# EAGLE design 24CH-2x24CH (EAGLE 6.6.0)
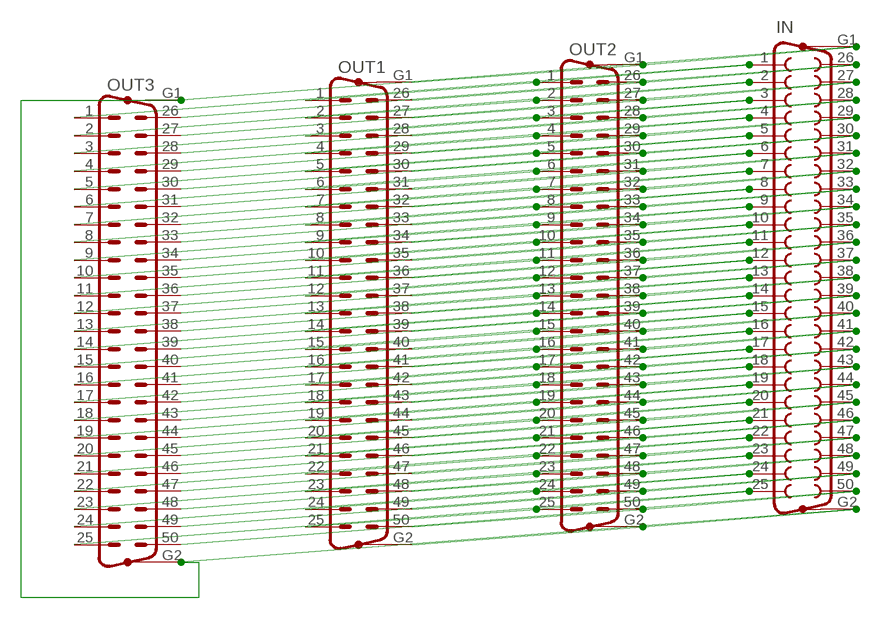
[diagram p0: schematic, sheet 1]

## Parts
IN  F50VP  [F50VP]
OUT1  M50VP  [M50VP]
OUT2  M50VP  [M50VP]
OUT3  M50VP  [M50VP]

## Nets
GND1: IN.G1 IN.G2 OUT1.G1 OUT1.G2 OUT2.G1 OUT2.G2 OUT3.G1 OUT3.G2
N$1: IN.35 OUT1.35 OUT2.35 OUT3.35
N$2: IN.38 OUT1.38 OUT2.38 OUT3.38
N$3: IN.1 OUT1.1 OUT2.1 OUT3.1
N$4: IN.18 OUT1.18 OUT2.18 OUT3.18
N$5: IN.2 OUT1.2 OUT2.2 OUT3.2
N$6: IN.19 OUT1.19 OUT2.19 OUT3.19
N$7: IN.3 OUT1.3 OUT2.3 OUT3.3
N$8: IN.20 OUT1.20 OUT2.20 OUT3.20
N$9: IN.4 OUT1.4 OUT2.4 OUT3.4
N$10: IN.21 OUT1.21 OUT2.21 OUT3.21
N$11: IN.5 OUT1.5 OUT2.5 OUT3.5
N$12: IN.22 OUT1.22 OUT2.22 OUT3.22
N$13: IN.6 OUT1.6 OUT2.6 OUT3.6
N$14: IN.23 OUT1.23 OUT2.23 OUT3.23
N$15: IN.7 OUT1.7 OUT2.7 OUT3.7
N$16: IN.24 OUT1.24 OUT2.24 OUT3.24
N$17: IN.8 OUT1.8 OUT2.8 OUT3.8
N$18: IN.25 OUT1.25 OUT2.25 OUT3.25
N$19: IN.9 OUT1.9 OUT2.9 OUT3.9
N$20: IN.26 OUT1.26 OUT2.26 OUT3.26
N$21: IN.10 OUT1.10 OUT2.10 OUT3.10
N$22: IN.27 OUT1.27 OUT2.27 OUT3.27
N$23: IN.11 OUT1.11 OUT2.11 OUT3.11
N$24: IN.28 OUT1.28 OUT2.28 OUT3.28
N$25: IN.12 OUT1.12 OUT2.12 OUT3.12
N$26: IN.29 OUT1.29 OUT2.29 OUT3.29
N$27: IN.13 OUT1.13 OUT2.13 OUT3.13
N$28: IN.30 OUT1.30 OUT2.30 OUT3.30
N$29: IN.14 OUT1.14 OUT2.14 OUT3.14
N$30: IN.31 OUT1.31 OUT2.31 OUT3.31
N$31: IN.15 OUT1.15 OUT2.15 OUT3.15
N$32: IN.32 OUT1.32 OUT2.32 OUT3.32
N$33: IN.16 OUT1.16 OUT2.16 OUT3.16
N$34: IN.33 OUT1.33 OUT2.33 OUT3.33
N$35: IN.17 OUT1.17 OUT2.17 OUT3.17
N$36: IN.40 OUT1.40 OUT2.40 OUT3.40
N$37: IN.39 OUT1.39 OUT2.39 OUT3.39
N$38: IN.34 OUT1.34 OUT2.34 OUT3.34
N$39: IN.36 OUT1.36 OUT2.36 OUT3.36
N$40: IN.37 OUT1.37 OUT2.37 OUT3.37
N$41: IN.41 OUT1.41 OUT2.41 OUT3.41
N$42: IN.42 OUT1.42 OUT2.42 OUT3.42
N$43: IN.43 OUT1.43 OUT2.43 OUT3.43
N$44: IN.44 OUT1.44 OUT2.44 OUT3.44
N$45: IN.45 OUT1.45 OUT2.45 OUT3.45
N$46: IN.46 OUT1.46 OUT2.46 OUT3.46
N$47: IN.47 OUT1.47 OUT2.47 OUT3.47
N$48: IN.48 OUT1.48 OUT2.48 OUT3.48
N$49: IN.49 OUT1.49 OUT2.49 OUT3.49
N$50: IN.50 OUT1.50 OUT2.50 OUT3.50

## Library data of the parts
IN = con-subd:F50VP: SUB-D; OC_FARNELL: unknown; OC_NEWARK: unknown
OUT1-OUT3 = con-subd:M50VP: SUB-D; OC_FARNELL: unknown; OC_NEWARK: unknown

## Board
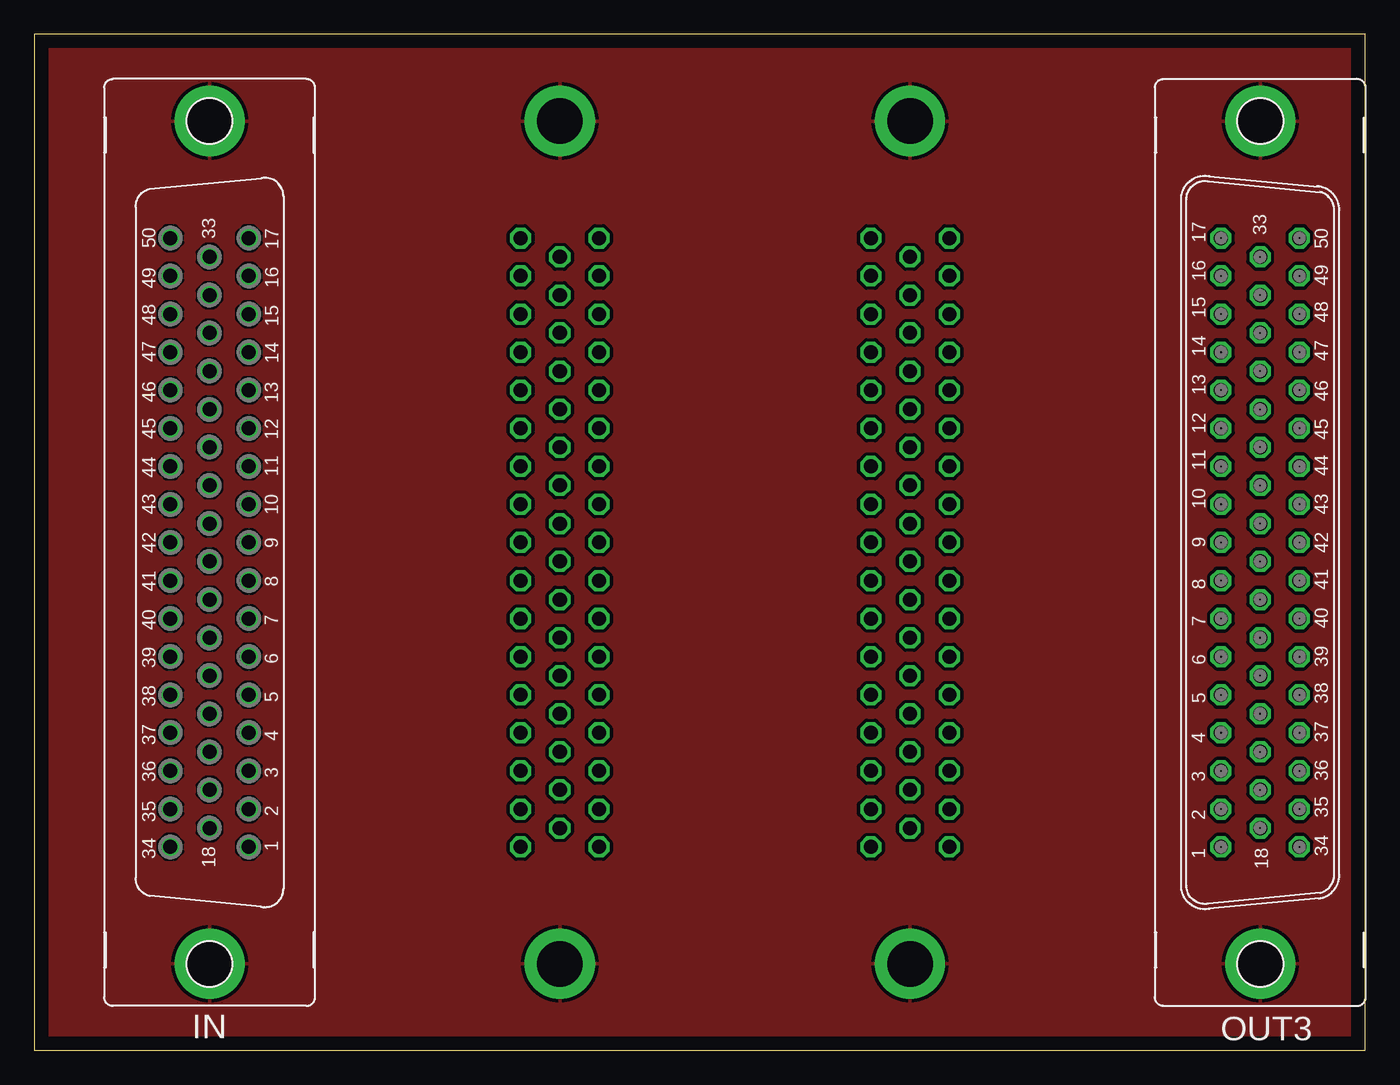
[diagram p1: board, top side]
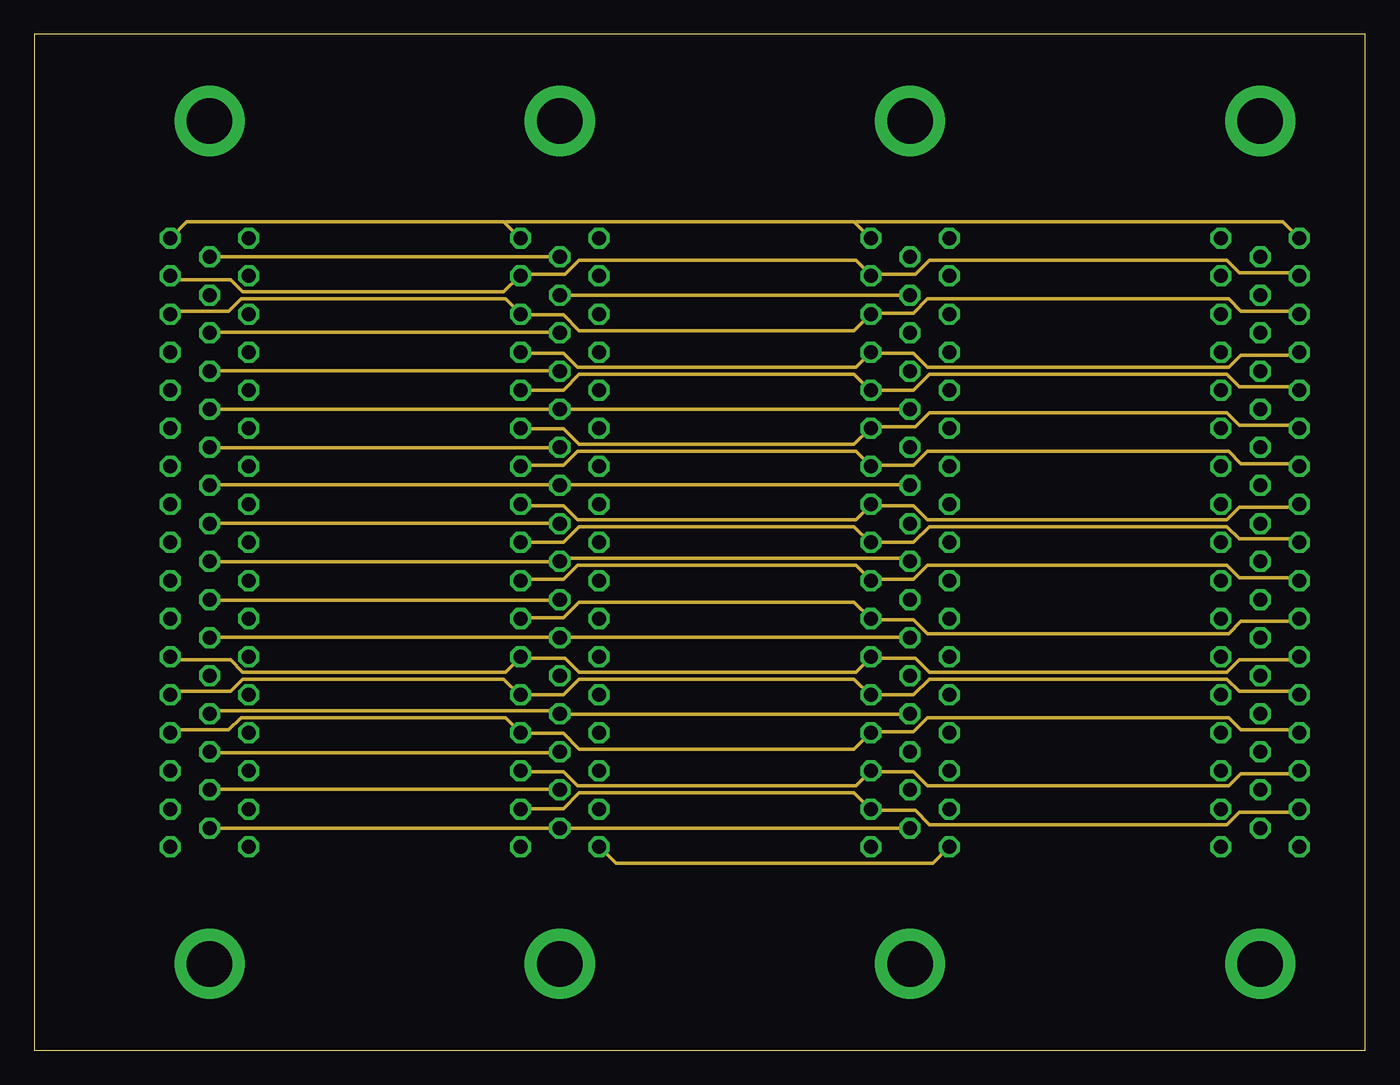
[diagram p2: board, inner layer Route2]
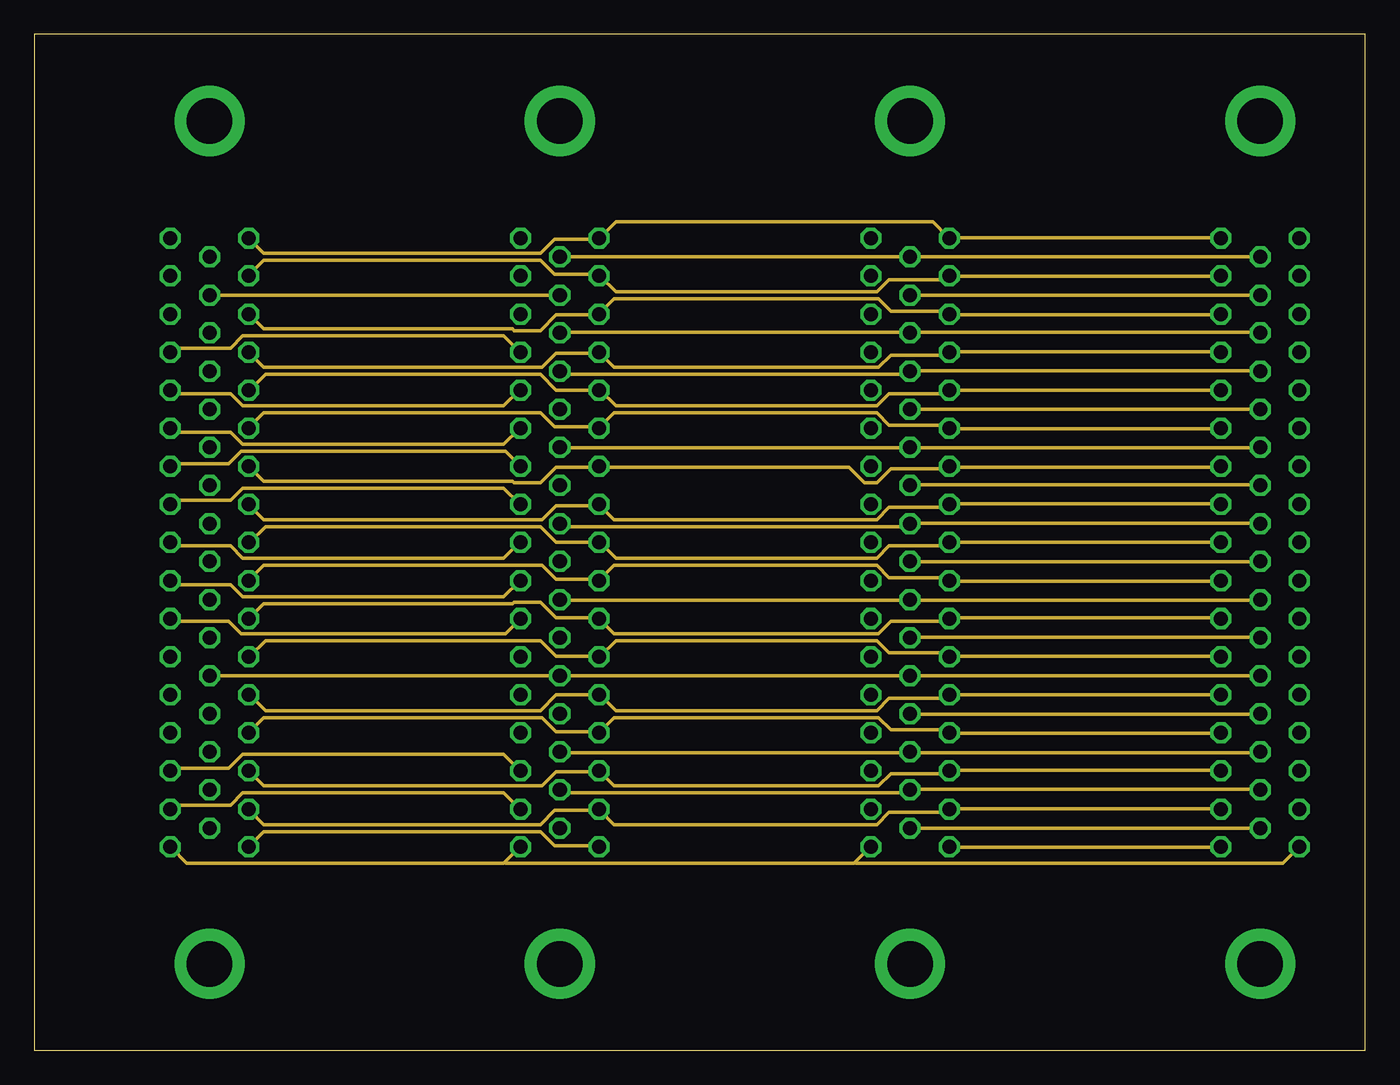
[diagram p3: board, inner layer Route15]
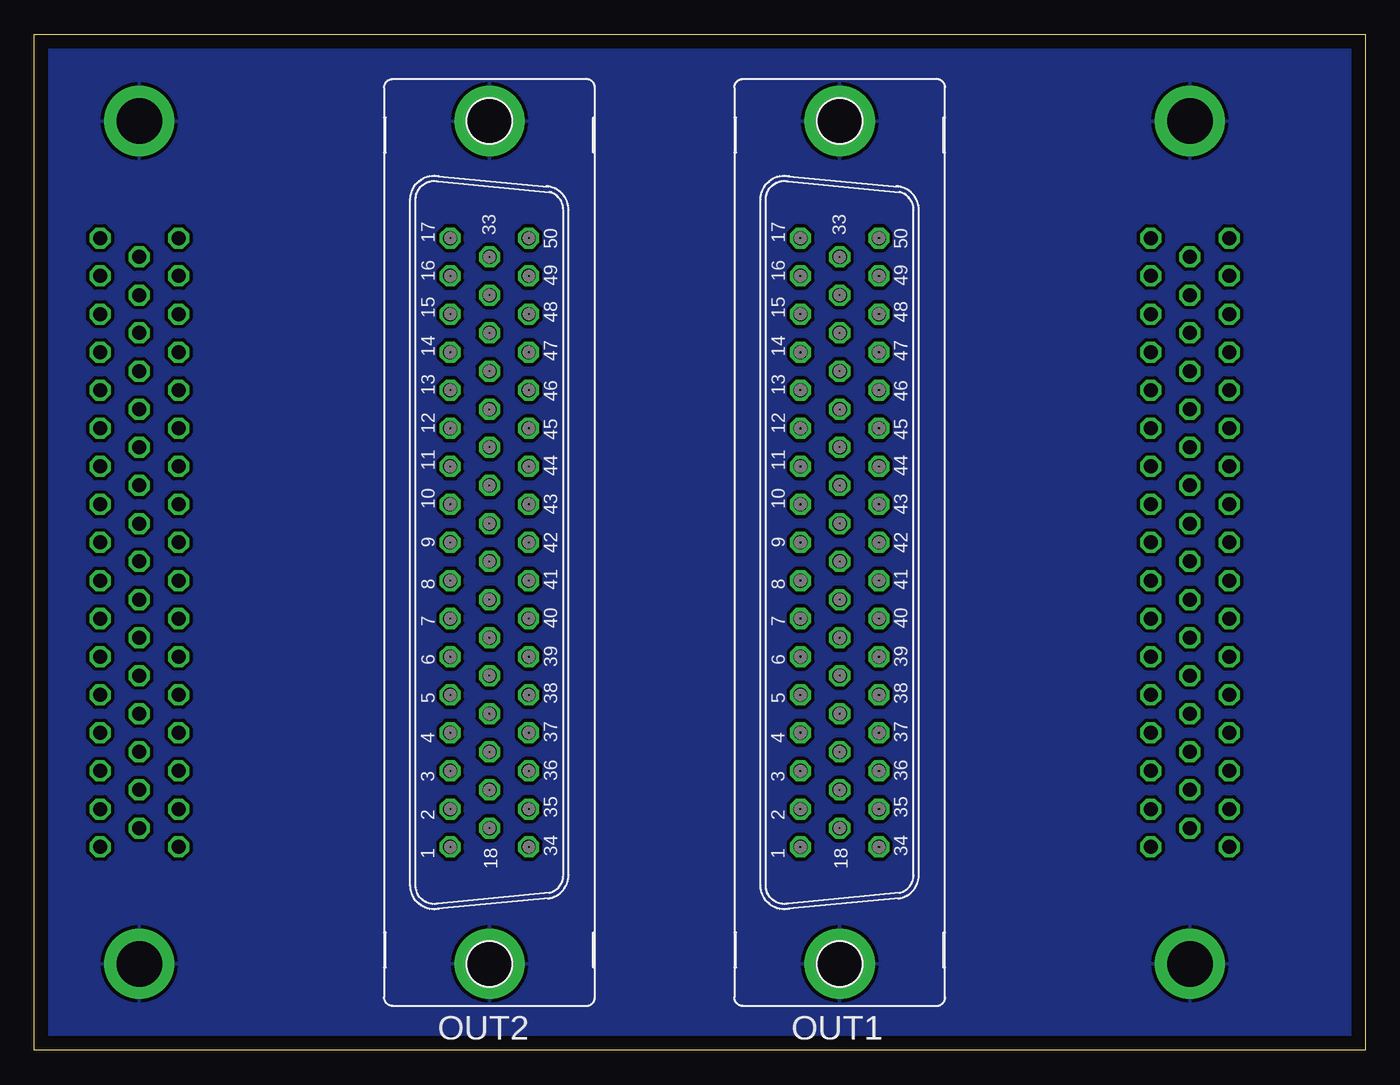
[diagram p4: board, bottom side, seen from below]

Size 96.5 x 73.66 mm. Coordinates in mm from the lower left corner, seen from the top.
Outline: 0,0 96.5,0 96.5,73.66 0,73.66 0,0
Copper layers (1*2*15*16): Top 0.035mm / dielectric 1.5mm / Route2 0.035mm / dielectric 0.15mm / Route15 0.035mm / dielectric 0.2mm / Bottom 0.035mm
Design rules "default *": minimum track width 10mil, minimum drill 24mil, track to track 8mil, track to pad 8mil, pad to pad 8mil, via to via 8mil, smd to smd 8mil, copper to edge 40mil, drill to drill 8mil, minimum pad ring 10mil, minimum via ring 8mil, stop-mask expansion 4mil, vias tented up to drill 0mil, thermal gap 10mil

### Footprints (pad centres in the part's own frame; a part is rotated, then mirrored left to right if it is on the bottom)
F50VP = drill 1.016 octagon: 1 -22.073,-2.845; 2 -19.329,-2.845; 3 -16.561,-2.845; 4 -13.792,-2.845; 5 -11.049,-2.845; 6 -8.28,-2.845; 7 -5.512,-2.845; 8 -2.769,-2.845; 9 0,-2.845; 10 2.769,-2.845; 11 5.512,-2.845; 12 8.28,-2.845; 13 11.049,-2.845; 14 13.792,-2.845; 15 16.561,-2.845; 16 19.329,-2.845; 17 22.073,-2.845; 18 -20.701,0; 19 -17.932,0; 20 -15.189,0; 21 -12.421,0; 22 -9.652,0; 23 -6.909,0; 24 -4.14,0; 25 -1.372,0; 26 1.372,0; 27 4.14,0; 28 6.909,0; 29 9.652,0; 30 12.421,0; 31 15.189,0; 32 17.932,0; 33 20.701,0; 34 -22.073,2.845; 35 -19.329,2.845; 36 -16.561,2.845; 37 -13.792,2.845; 38 -11.049,2.845; 39 -8.28,2.845; 40 -5.512,2.845; 41 -2.769,2.845; 42 0,2.845; 43 2.769,2.845; 44 5.512,2.845; 45 8.28,2.845; 46 11.049,2.845; 47 13.792,2.845; 48 16.561,2.845; 49 19.329,2.845; 50 22.073,2.845 | drill 3.302 pad 5.08: G1 30.556,0; G2 -30.556,0
M50VP = drill 1.016 octagon: 1 -22.073,2.845; 2 -19.329,2.845; 3 -16.561,2.845; 4 -13.792,2.845; 5 -11.049,2.845; 6 -8.28,2.845; 7 -5.512,2.845; 8 -2.769,2.845; 9 0,2.845; 10 2.769,2.845; 11 5.512,2.845; 12 8.28,2.845; 13 11.049,2.845; 14 13.792,2.845; 15 16.561,2.845; 16 19.329,2.845; 17 22.073,2.845; 18 -20.701,0; 19 -17.932,0; 20 -15.189,0; 21 -12.421,0; 22 -9.652,0; 23 -6.909,0; 24 -4.14,0; 25 -1.372,0; 26 1.372,0; 27 4.14,0; 28 6.909,0; 29 9.652,0; 30 12.421,0; 31 15.189,0; 32 17.932,0; 33 20.701,0; 34 -22.073,-2.845; 35 -19.329,-2.845; 36 -16.561,-2.845; 37 -13.792,-2.845; 38 -11.049,-2.845; 39 -8.28,-2.845; 40 -5.512,-2.845; 41 -2.769,-2.845; 42 0,-2.845; 43 2.769,-2.845; 44 5.512,-2.845; 45 8.28,-2.845; 46 11.049,-2.845; 47 13.792,-2.845; 48 16.561,-2.845; 49 19.329,-2.845; 50 22.073,-2.845 | drill 3.302 pad 5.08: G1 -30.556,0; G2 30.556,0

### Placement (x,y rotation side)
IN  12.7,36.83 90 top
OUT1  38.1,36.83 90 bottom
OUT2  63.5,36.83 90 bottom
OUT3  88.9,36.83 90 top

### Tracks (layer width: path | path; a pad name or v marks a point on that pad's centre or on a via)
GND1
  pour Top (isolate 0.254): 0,73.66 96.52,73.66 96.52,0 0,0
  pour Bottom (isolate 0.254): 0,73.66 96.52,73.66 96.52,0 0,0
N$1
  Route2 0.254: OUT1.35 35.31,17.53 38.35,17.53 39.5,18.67 59.44,18.67 60.58,17.53 OUT2.35 60.71,17.4 63.88,17.4 64.9,16.38 86.49,16.38 87.38,17.27 91.57,17.27 91.69,17.4 OUT3.35
  Route15 0.254: IN.35 9.91,17.53 10.16,17.78 14.22,17.78 15.11,18.67 34.04,18.67 35.18,17.53 OUT1.35
N$2
  Route2 0.254: IN.38 9.91,25.78 10.16,26.04 14.22,26.04 15.11,26.92 34.04,26.92 35.18,25.78 OUT1.38 38.35,25.78 39.5,26.92 59.44,26.92 60.58,25.78 OUT2.38 63.75,25.78 64.9,26.92 86.49,26.92 87.38,26.04 91.44,26.04 91.69,25.78 OUT3.38
N$3
  Route2 0.254: OUT2.1 66.29,14.73 65.15,13.59 42.16,13.59 41.02,14.73 OUT1.1
  Route15 0.254: OUT2.1 66.42,14.73 85.98,14.73 OUT3.1 | IN.1 15.62,14.86 16.64,15.88 36.7,15.88 37.72,14.86 40.89,14.86 OUT1.1
N$4
  Route2 0.254: IN.18 OUT1.18 OUT2.18
  Route15 0.254: OUT3.18 OUT2.18
N$5
  Route15 0.254: OUT3.2 85.98,17.53 66.42,17.53 OUT2.2 66.29,17.4 66.17,17.27 61.98,17.27 61.09,16.38 42.04,16.38 41.02,17.4 OUT1.2 40.89,17.4 37.72,17.4 36.7,16.38 16.64,16.38 15.62,17.4 IN.2
N$6
  Route2 0.254: IN.19 12.7,18.92 38.1,18.92 OUT1.19
  Route15 0.254: OUT3.19 88.9,18.92 63.5,18.92 OUT2.19 63.5,18.8 63.37,18.67 38.23,18.67 38.1,18.8 OUT1.19
N$7
  Route15 0.254: OUT3.3 85.98,20.32 66.42,20.32 OUT2.3 66.29,20.19 66.17,20.07 62.1,20.07 61.21,19.18 42.04,19.18 OUT1.3 40.89,20.19 37.85,20.19 36.83,19.18 16.64,19.18 IN.3
N$8
  Route2 0.254: IN.20 12.7,21.59 38.1,21.59 OUT1.20
  Route15 0.254: 63.5,21.59 38.1,21.59 OUT1.20 | 63.5,21.59 88.9,21.59 OUT3.20 | 63.5,21.59 OUT2.20
N$9
  Route15 0.254: OUT3.4 85.98,22.99 66.42,22.99 OUT2.4 66.29,23.11 66.17,23.24 62.1,23.24 61.21,24.13 42.04,24.13 OUT1.4 40.89,23.11 37.85,23.11 36.83,24.13 16.64,24.13 IN.4
N$10
  Route2 0.254: IN.21 12.7,24.51 12.83,24.64 37.97,24.64 38.1,24.51 OUT1.21 38.1,24.38 63.5,24.38 OUT2.21
  Route15 0.254: OUT2.21 63.5,24.38 88.9,24.38 OUT3.21
N$11
  Route15 0.254: OUT3.5 OUT2.5 66.29,25.78 66.04,25.53 61.98,25.53 61.09,24.64 42.16,24.64 41.02,25.78 OUT1.5 37.85,25.78 36.7,24.64 16.76,24.64 15.62,25.78 IN.5
N$12
  Route15 0.254: IN.22 OUT1.22 OUT2.22 OUT3.22
N$13
  Route15 0.254: OUT3.6 85.98,28.57 66.42,28.57 OUT2.6 66.29,28.57 66.04,28.83 61.98,28.83 61.09,29.72 42.16,29.72 41.02,28.57 OUT1.6 40.89,28.57 37.85,28.57 36.7,29.72 16.76,29.72 15.62,28.57 IN.6
N$14
  Route2 0.254: 38.1,29.97 12.7,29.97 IN.23 | 38.1,29.97 63.5,29.97 OUT2.23 | 38.1,29.97 OUT1.23
  Route15 0.254: OUT2.23 63.5,29.97 88.9,29.97 OUT3.23
N$15
  Route15 0.254: OUT3.7 85.98,31.37 66.42,31.37 OUT2.7 66.29,31.24 66.17,31.11 62.1,31.11 61.21,30.23 42.04,30.23 OUT1.7 40.89,31.37 37.85,31.37 36.7,32.51 34.8,32.51 34.67,32.38 16.64,32.38 15.62,31.37 IN.7
N$16
  Route2 0.254: IN.24 12.7,32.64 38.1,32.64 OUT1.24
  Route15 0.254: 63.5,32.64 38.1,32.64 OUT1.24 | 63.5,32.64 88.9,32.64 OUT3.24 | 63.5,32.64 OUT2.24
N$17
  Route15 0.254: OUT3.8 85.98,34.04 66.42,34.04 OUT2.8 66.29,34.16 66.17,34.29 61.98,34.29 61.09,35.18 42.04,35.18 41.02,34.16 OUT1.8 40.89,34.16 37.85,34.16 36.83,35.18 16.64,35.18 15.62,34.16 IN.8
N$18
  Route2 0.254: IN.25 12.7,35.43 38.1,35.43 OUT1.25 38.1,35.56 38.23,35.69 63.37,35.69 63.5,35.56 OUT2.25
  Route15 0.254: OUT2.25 63.5,35.43 88.9,35.43 OUT3.25
N$19
  Route15 0.254: OUT3.9 OUT2.9 66.29,36.83 66.04,36.58 61.98,36.58 61.09,35.69 42.16,35.69 41.02,36.83 OUT1.9 37.85,36.83 36.7,37.97 16.76,37.97 15.62,36.83 IN.9
N$20
  Route2 0.254: IN.26 12.7,38.23 38.1,38.23 OUT1.26
  Route15 0.254: OUT3.26 88.9,38.23 63.5,38.23 OUT2.26 63.5,38.1 63.37,37.97 38.23,37.97 38.1,38.1 OUT1.26
N$21
  Route15 0.254: OUT3.10 85.98,39.62 66.42,39.62 OUT2.10 66.29,39.5 66.17,39.37 61.98,39.37 61.09,38.48 42.04,38.48 41.02,39.5 OUT1.10 40.89,39.5 37.85,39.5 36.83,38.48 16.64,38.48 15.62,39.5 IN.10
N$22
  Route2 0.254: 38.1,41.02 12.7,41.02 IN.27 | 38.1,41.02 63.5,41.02 OUT2.27 | 38.1,41.02 OUT1.27
  Route15 0.254: OUT2.27 63.5,41.02 88.9,41.02 OUT3.27
N$23
  Route15 0.254: OUT3.11 85.98,42.29 66.42,42.29 OUT2.11 66.17,42.16 62.1,42.16 61.09,41.15 60.2,41.15 59.05,42.29 41.02,42.29 OUT1.11 40.89,42.29 37.85,42.29 36.7,41.15 34.8,41.15 34.67,41.27 16.64,41.27 15.62,42.29 IN.11
N$24
  Route2 0.254: IN.28 12.7,43.69 38.1,43.69 OUT1.28
  Route15 0.254: 63.5,43.69 38.1,43.69 OUT1.28 | 63.5,43.69 88.9,43.69 OUT3.28 | 63.5,43.69 OUT2.28
N$25
  Route15 0.254: OUT3.12 85.98,45.09 66.42,45.09 OUT2.12 66.29,45.21 66.17,45.34 61.98,45.34 61.09,46.23 42.04,46.23 41.02,45.21 OUT1.12 40.89,45.21 37.72,45.21 36.7,46.23 16.64,46.23 15.62,45.21 IN.12
N$26
  Route2 0.254: IN.29 OUT1.29 OUT2.29
  Route15 0.254: OUT3.29 OUT2.29
N$27
  Route15 0.254: OUT3.13 OUT2.13 66.29,47.88 66.04,47.62 61.98,47.62 61.09,46.74 42.16,46.74 41.02,47.88 OUT1.13 37.85,47.88 36.7,49.02 16.76,49.02 15.62,47.88 IN.13
N$28
  Route2 0.254: IN.30 12.7,49.28 38.1,49.28 OUT1.30
  Route15 0.254: OUT3.30 88.9,49.28 63.5,49.28 OUT2.30 63.5,49.15 63.37,49.02 38.23,49.02 38.1,49.15 OUT1.30
N$29
  Route15 0.254: OUT3.14 85.98,50.67 66.42,50.67 OUT2.14 66.29,50.55 66.17,50.42 62.1,50.42 61.21,49.53 42.04,49.53 OUT1.14 40.89,50.55 37.85,50.55 36.83,49.53 16.64,49.53 IN.14
N$30
  Route2 0.254: IN.31 12.7,52.07 38.1,52.07 OUT1.31
  Route15 0.254: 63.5,52.07 38.1,52.07 OUT1.31 | 63.5,52.07 88.9,52.07 OUT3.31 | 63.5,52.07 OUT2.31
N$31
  Route15 0.254: OUT3.15 85.98,53.34 66.42,53.34 OUT2.15 66.29,53.47 66.17,53.59 62.1,53.59 61.21,54.48 42.04,54.48 OUT1.15 40.89,53.34 37.85,53.34 36.7,52.2 34.8,52.2 34.67,52.32 16.64,52.32 15.62,53.34 IN.15
N$32
  Route2 0.254: OUT1.32 38.1,54.74 63.5,54.74 OUT2.32
  Route15 0.254: IN.32 12.7,54.74 38.1,54.74 OUT1.32 | OUT2.32 63.5,54.74 88.9,54.74 OUT3.32
N$33
  Route15 0.254: OUT3.16 85.98,56.13 66.42,56.13 OUT2.16 66.29,56.13 66.04,55.88 61.98,55.88 61.09,54.99 42.16,54.99 41.02,56.13 OUT1.16 40.89,56.26 37.72,56.26 36.7,57.28 16.64,57.28 15.62,56.26 IN.16
N$34
  Route2 0.254: OUT1.33 IN.33
  Route15 0.254: OUT1.33 OUT2.33 OUT3.33
N$35
  Route15 0.254: OUT3.17 85.98,58.93 66.42,58.93 OUT2.17 66.29,58.93 65.15,60.07 42.16,60.07 41.02,58.93 OUT1.17 40.89,58.8 37.72,58.8 36.7,57.78 16.64,57.78 15.62,58.8 IN.17
N$36
  Route2 0.254: OUT1.40 35.31,31.37 38.35,31.37 39.5,32.51 59.44,32.51 60.58,31.37 OUT2.40 60.71,31.24 63.75,31.24 64.77,30.23 86.61,30.23 87.5,31.11 91.57,31.11 91.69,31.24 OUT3.40
  Route15 0.254: OUT1.40 34.16,30.23 14.99,30.23 14.1,31.11 10.03,31.11 9.91,31.24 IN.40
N$37
  Route2 0.254: IN.39 9.91,28.45 10.03,28.32 14.22,28.32 15.11,27.43 34.16,27.43 35.18,28.45 OUT1.39 35.31,28.45 38.48,28.45 39.5,27.43 59.56,27.43 60.58,28.45 OUT2.39 60.71,28.45 63.88,28.45 64.9,27.43 86.49,27.43 87.38,28.32 91.57,28.32 91.69,28.45 OUT3.39
N$38
  Route15 0.254: 34.1,13.65 35.18,14.73 OUT1.34 | 34.1,13.65 34.04,13.59 11.05,13.59 9.91,14.73 IN.34 | 59.5,13.65 59.44,13.59 34.16,13.59 34.1,13.65 | 59.5,13.65 60.58,14.73 OUT2.34 | OUT3.34 91.69,14.73 90.55,13.59 59.56,13.59 59.5,13.65
N$39
  Route2 0.254: OUT1.36 35.31,20.19 38.35,20.19 39.37,19.18 59.56,19.18 OUT2.36 60.71,20.19 63.75,20.19 64.77,19.18 86.61,19.18 87.5,20.07 91.57,20.07 91.69,20.19 OUT3.36
  Route15 0.254: IN.36 10.03,20.45 14.1,20.45 15.11,21.46 34.04,21.46 35.18,20.32 OUT1.36
N$40
  Route2 0.254: IN.37 9.91,23.11 10.03,23.24 14.1,23.24 14.99,24.13 34.16,24.13 OUT1.37 35.31,22.99 38.35,22.99 39.5,21.84 59.44,21.84 60.58,22.99 OUT2.37 60.71,23.11 63.75,23.11 64.77,24.13 86.61,24.13 87.5,23.24 91.57,23.24 91.69,23.11 OUT3.37
N$41
  Route2 0.254: OUT1.41 35.31,34.16 38.35,34.16 39.37,35.18 59.56,35.18 60.58,34.16 OUT2.41 60.71,34.16 63.75,34.16 64.77,35.18 86.49,35.18 87.38,34.29 91.57,34.29 91.69,34.16 OUT3.41
  Route15 0.254: IN.41 9.91,34.04 10.16,33.78 14.22,33.78 15.11,32.89 34.04,32.89 35.18,34.04 OUT1.41
N$42
  Route2 0.254: OUT1.42 38.35,36.83 39.5,37.97 59.44,37.97 60.58,36.83 OUT2.42 63.75,36.83 64.9,37.97 86.49,37.97 87.38,37.08 91.44,37.08 91.69,36.83 OUT3.42
  Route15 0.254: IN.42 9.91,36.83 10.16,36.58 14.22,36.58 15.11,35.69 34.04,35.69 35.18,36.83 OUT1.42
N$43
  Route2 0.254: OUT1.43 35.31,39.5 38.35,39.5 39.37,38.48 59.56,38.48 60.58,39.5 OUT2.43 60.71,39.5 63.75,39.5 64.77,38.48 86.49,38.48 87.38,39.37 91.57,39.37 91.69,39.5 OUT3.43
  Route15 0.254: IN.43 9.91,39.62 10.16,39.88 14.22,39.88 15.11,40.77 34.04,40.77 35.18,39.62 OUT1.43
N$44
  Route2 0.254: OUT1.44 35.31,42.42 38.35,42.42 39.37,43.43 59.56,43.43 OUT2.44 60.71,42.42 63.75,42.42 64.77,43.43 86.61,43.43 87.5,42.55 91.57,42.55 91.69,42.42 OUT3.44
  Route15 0.254: OUT1.44 34.16,43.43 14.99,43.43 14.1,42.55 10.03,42.55 9.91,42.42 IN.44
N$45
  Route2 0.254: OUT1.45 35.31,45.09 38.35,45.09 39.5,43.94 59.44,43.94 60.58,45.09 OUT2.45 60.71,45.21 63.88,45.21 64.9,46.23 86.49,46.23 87.38,45.34 91.57,45.34 91.69,45.21 OUT3.45
  Route15 0.254: IN.45 9.91,45.09 10.16,44.83 14.22,44.83 15.11,43.94 34.04,43.94 35.18,45.09 OUT1.45
N$46
  Route2 0.254: OUT1.46 38.35,47.88 39.5,49.02 59.44,49.02 60.58,47.88 OUT2.46 63.75,47.88 64.9,49.02 86.49,49.02 87.38,48.13 91.44,48.13 91.69,47.88 OUT3.46
  Route15 0.254: IN.46 9.91,47.88 10.16,47.62 14.22,47.62 15.11,46.74 34.04,46.74 35.18,47.88 OUT1.46
N$47
  Route2 0.254: OUT1.47 35.31,50.55 38.35,50.55 39.37,49.53 59.56,49.53 OUT2.47 60.71,50.55 63.75,50.55 64.77,49.53 86.61,49.53 87.5,50.42 91.57,50.42 91.69,50.55 OUT3.47
  Route15 0.254: IN.47 10.16,50.93 14.22,50.93 15.11,51.82 34.04,51.82 35.18,50.67 OUT1.47
N$48
  Route2 0.254: IN.48 9.91,53.47 10.03,53.59 14.1,53.59 14.99,54.48 34.16,54.48 OUT1.48 35.31,53.34 38.35,53.34 39.5,52.2 59.44,52.2 60.58,53.34 OUT2.48 60.71,53.47 63.75,53.47 64.77,54.48 86.61,54.48 87.5,53.59 91.57,53.59 91.69,53.47 OUT3.48
N$49
  Route2 0.254: IN.49 9.91,56.13 10.16,55.88 14.22,55.88 15.11,54.99 34.04,54.99 35.18,56.13 OUT1.49 35.31,56.26 38.48,56.26 39.5,57.28 59.56,57.28 60.58,56.26 OUT2.49 60.71,56.26 63.88,56.26 64.9,57.28 86.49,57.28 87.38,56.39 91.57,56.39 91.69,56.26 OUT3.49
N$50
  Route2 0.254: 34.1,60.01 35.18,58.93 OUT1.50 | 34.1,60.01 34.04,60.07 11.05,60.07 9.91,58.93 IN.50 | 59.5,60.01 59.44,60.07 34.16,60.07 34.1,60.01 | 59.5,60.01 60.58,58.93 OUT2.50 | OUT3.50 91.69,58.93 90.55,60.07 59.56,60.07 59.5,60.01